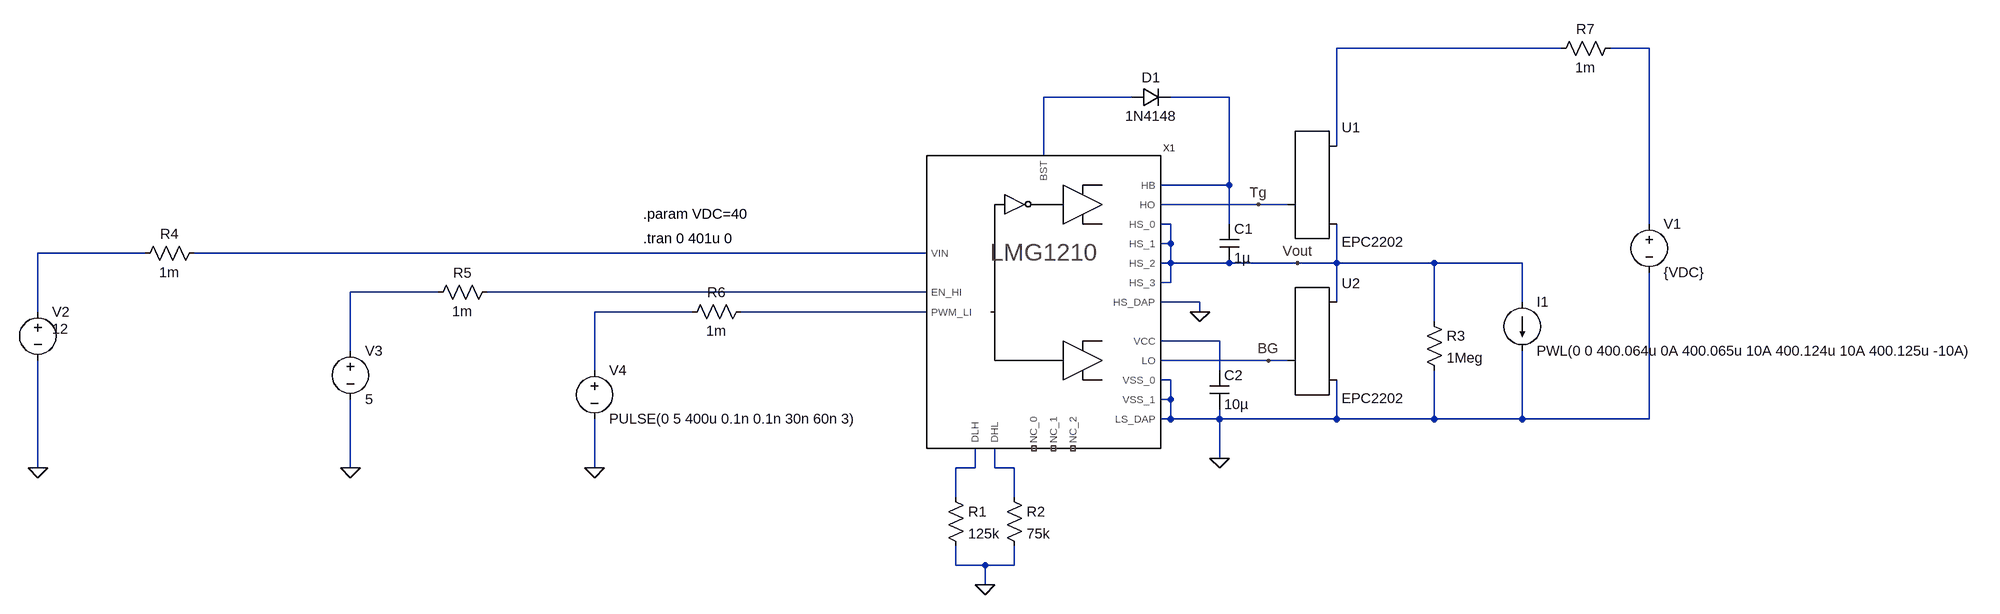
[diagram p0: schematic switch-loss-test.asc]
switch-loss-test.asc, the LTspice schematic file:
Version 4
SHEET 1 2568 808
WIRE 1824 -112 1456 -112
WIRE 1968 -112 1904 -112
WIRE 1120 -32 976 -32
WIRE 1280 -32 1184 -32
WIRE 1456 48 1456 -112
WIRE 976 64 976 -32
WIRE 1280 112 1280 -32
WIRE 1280 112 1168 112
WIRE 1328 144 1168 144
WIRE 1376 144 1328 144
WIRE 1184 176 1168 176
WIRE 1280 176 1280 112
WIRE 1968 176 1968 -112
WIRE 1184 208 1184 176
WIRE 1184 208 1168 208
WIRE -496 224 -672 224
WIRE 784 224 -416 224
WIRE 1184 240 1184 208
WIRE 1184 240 1168 240
WIRE 1280 240 1184 240
WIRE 1392 240 1280 240
WIRE 1456 240 1456 176
WIRE 1456 240 1392 240
WIRE 1616 240 1456 240
WIRE 1760 240 1616 240
WIRE 1184 272 1184 240
WIRE 1184 272 1168 272
WIRE -16 288 -160 288
WIRE 784 288 64 288
WIRE 1232 304 1168 304
WIRE 1456 304 1456 240
WIRE 1760 304 1760 240
WIRE -672 320 -672 224
WIRE 400 320 240 320
WIRE 784 320 480 320
WIRE 1232 320 1232 304
WIRE 1616 336 1616 240
WIRE 1264 368 1168 368
WIRE -160 384 -160 288
WIRE 1344 400 1168 400
WIRE 1376 400 1344 400
WIRE 240 416 240 320
WIRE 1264 416 1264 368
WIRE 1184 432 1168 432
WIRE 1184 464 1184 432
WIRE 1184 464 1168 464
WIRE 1184 496 1184 464
WIRE 1184 496 1168 496
WIRE 1264 496 1264 480
WIRE 1264 496 1184 496
WIRE 1456 496 1456 432
WIRE 1456 496 1264 496
WIRE 1616 496 1616 416
WIRE 1616 496 1456 496
WIRE 1760 496 1760 384
WIRE 1760 496 1616 496
WIRE 1968 496 1968 256
WIRE 1968 496 1760 496
WIRE 1264 560 1264 496
WIRE -672 576 -672 400
WIRE -160 576 -160 464
WIRE 240 576 240 496
WIRE 864 576 864 544
WIRE 864 576 832 576
WIRE 896 576 896 544
WIRE 928 576 896 576
WIRE 832 624 832 576
WIRE 928 624 928 576
WIRE 832 736 832 704
WIRE 880 736 832 736
WIRE 928 736 928 704
WIRE 928 736 880 736
WIRE 880 768 880 736
FLAG 1264 560 0
FLAG -672 576 0
FLAG 880 768 0
FLAG -160 576 0
FLAG 240 576 0
FLAG 1232 320 0
FLAG 1328 144 Tg
FLAG 1344 400 BG
FLAG 1392 240 Vout
SYMBOL EPCGaN 1376 144 R0
SYMATTR InstName U1
SYMATTR Value EPC2202
SYMBOL diode 1120 -16 R270
WINDOW 0 32 32 VTop 2
WINDOW 3 0 32 VBottom 2
SYMATTR InstName D1
SYMATTR Value 1N4148
SYMBOL cap 1264 176 R0
SYMATTR InstName C1
SYMATTR Value 1µ
SYMBOL EPCGaN 1376 400 R0
SYMATTR InstName U2
SYMATTR Value EPC2202
SYMBOL cap 1248 416 R0
SYMATTR InstName C2
SYMATTR Value 10µ
SYMBOL voltage 1968 160 R0
WINDOW 123 0 0 Left 0
WINDOW 39 0 0 Left 0
SYMATTR InstName V1
SYMATTR Value {VDC}
SYMBOL voltage -672 304 R0
WINDOW 3 24 44 Left 2
WINDOW 123 0 0 Left 0
WINDOW 39 0 0 Left 0
SYMATTR Value 12
SYMATTR InstName V2
SYMBOL res 816 608 R0
SYMATTR InstName R1
SYMATTR Value 125k
SYMBOL res 912 608 R0
SYMATTR InstName R2
SYMATTR Value 75k
SYMBOL voltage -160 368 R0
WINDOW 123 0 0 Left 0
WINDOW 39 0 0 Left 0
SYMATTR InstName V3
SYMATTR Value 5
SYMBOL voltage 240 400 R0
WINDOW 123 0 0 Left 0
WINDOW 39 0 0 Left 0
SYMATTR InstName V4
SYMATTR Value PULSE(0 5 400u 0.1n 0.1n 30n 60n 3)
SYMBOL LMG1210 976 144 R0
SYMATTR InstName X1
SYMATTR Prefix ""
SYMBOL current 1760 304 R0
WINDOW 123 0 0 Left 0
WINDOW 39 0 0 Left 0
SYMATTR InstName I1
SYMATTR Value PWL(0 0 400.064u 0A 400.065u 10A 400.124u 10A 400.125u -10A)
SYMBOL res 1600 320 R0
SYMATTR InstName R3
SYMATTR Value 1Meg
SYMBOL res -400 208 R90
WINDOW 0 0 56 VBottom 2
WINDOW 3 32 56 VTop 2
SYMATTR InstName R4
SYMATTR Value 1m
SYMBOL res 80 272 R90
WINDOW 0 0 56 VBottom 2
WINDOW 3 32 56 VTop 2
SYMATTR InstName R5
SYMATTR Value 1m
SYMBOL res 496 304 R90
WINDOW 0 0 56 VBottom 2
WINDOW 3 32 56 VTop 2
SYMATTR InstName R6
SYMATTR Value 1m
SYMBOL res 1920 -128 R90
WINDOW 0 0 56 VBottom 2
WINDOW 3 32 56 VTop 2
SYMATTR InstName R7
SYMATTR Value 1m
TEXT 320 160 Left 2 !.param VDC=40
TEXT 320 200 Left 2 !.tran 0 401u 0

The netlist it stands for:
* switch-loss-test.asc
XU1 Tg N001 Vout EPC2202
D1 N003 N004 1N4148
C1 N004 Vout 1µ
XU2 BG Vout 0 EPC2202
C2 N011 0 10µ
V1 N002 0 {VDC}
V2 N005 0 12
R1 N012 0 125k
R2 N013 0 75k
V3 N007 0 5
V4 N009 0 PULSE(0 5 400u 0.1n 0.1n 30n 60n 3)
XX1 N004 Tg N010 Vout Vout Vout Vout 0 0 N006 BG N013 N012 N011 0 0 N008 NC_01 NC_02 NC_03 N003 LMG1210  ; pins HB HO PWM_LI HS_0 HS_1 HS_2 HS_3 HS_DAP LS_DAP VIN LO DHL DLH VCC VSS_0 VSS_1 EN_HI NC_0 NC_1 NC_2 BST
I1 Vout 0 PWL(0 0 400.064u 0A 400.065u 10A 400.124u 10A 400.125u -10A)
R3 Vout 0 1Meg
R4 N006 N005 1m
R5 N008 N007 1m
R6 N010 N009 1m
R7 N002 N001 1m
.model D D
.lib standard.dio
.param VDC=40
.tran 0 401u 0
.lib LMG1210_TRANS.lib
.backanno
.end